# EAGLE design Qwiic GPS-RTK2 - ublox ZED-F9P (EAGLE 9.5.1)
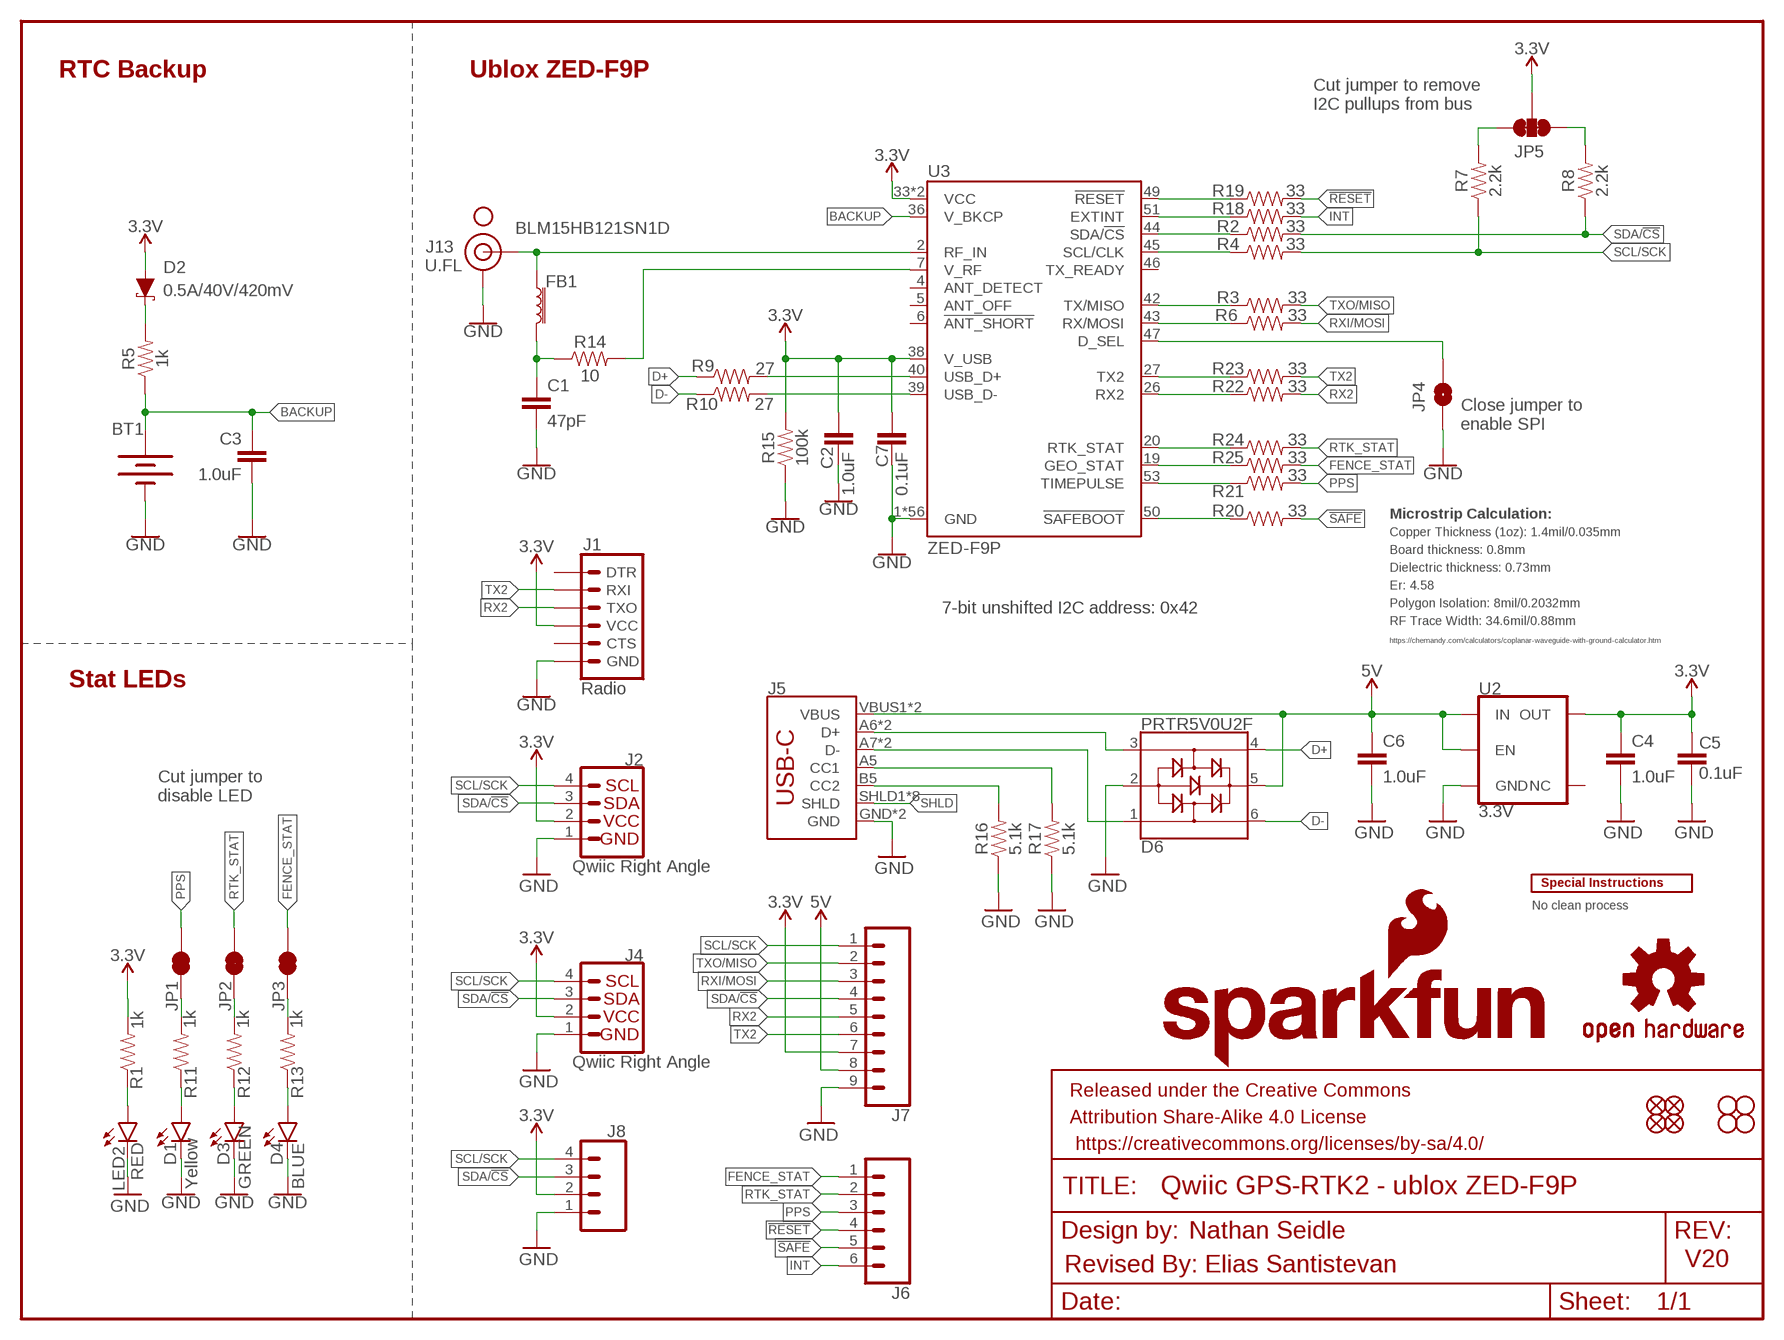
[diagram p0: schematic, sheet 1]

## Parts
BT1  ML414H_IV01E_BATTERY  [ML414H_IV01E]
C1  47pF  47PF-0603-50V-5%  [0603]
C2  1.0uF  1.0UF-0603-16V-10%  [0603]
C3  1.0uF  1.0UF-0603-16V-10%  [0603]
C4  1.0uF  1.0UF-0603-16V-10%  [0603]
C5  0.1uF  0.1UF-0603-25V-(+80/-20%)  [0603]
C6  1.0uF  1.0UF-0603-16V-10%  [0603]
C7  0.1uF  0.1UF-0603-25V-(+80/-20%)  [0603]
D1  Yellow  LED-YELLOW0603  [LED-0603]
D2  0.5A/40V/420mV  DIODE-SCHOTTKY-PMEG4005EJ  [SOD-323]
D3  GREEN  LED-GREEN0603  [LED-0603]
D4  BLUE  LED-BLUE0603  [LED-0603]
D6  PRTR5V0U2F  [SOT886]
FB1  FERRITE_BEAD-120_OHM-0402  [0402]
FRAME1  FRAME-LETTER  [CREATIVE_COMMONS]
J1  Radio  6_PIN_SERIAL_TARGET_NO_SILK  [1X06_NO_SILK]
J2  Qwiic Right Angle  I2C_STANDARDQWIIC  [JST04_1MM_RA]
J4  Qwiic Right Angle  I2C_STANDARDQWIIC  [JST04_1MM_RA]
J5  USB_C2-LAYER  [USB-C-16P]
J6  CONN_06NO_SILK_FEMALE_PTH  [1X06_NO_SILK]
J7  CONN_09NO_SILK  [1X09_NO_SILK]
J8  CONN_041X04_NO_SILK  [1X04_NO_SILK]
J13  U.FL  U.FL2PIN  [U.FL]
JP1  JUMPER-SMT_2_NC_TRACE_SILK  [SMT-JUMPER_2_NC_TRACE_SILK]
JP2  JUMPER-SMT_2_NC_TRACE_SILK  [SMT-JUMPER_2_NC_TRACE_SILK]
JP3  JUMPER-SMT_2_NC_TRACE_SILK  [SMT-JUMPER_2_NC_TRACE_SILK]
JP4  JUMPER-SMT_2_NO_SILK  [SMT-JUMPER_2_NO_SILK]
JP5  JUMPER-SMT_3_2-NC_TRACE_SILK  [SMT-JUMPER_3_2-NC_TRACE_SILK]
JP21  FIDUCIALUFIDUCIAL  [FIDUCIAL-MICRO]
JP31  STAND-OFFTIGHT  [STAND-OFF-TIGHT]
JP41  STAND-OFFTIGHT  [STAND-OFF-TIGHT]
JP61  FIDUCIALUFIDUCIAL  [FIDUCIAL-MICRO]
JP71  FIDUCIALUFIDUCIAL  [FIDUCIAL-MICRO]
JP81  FIDUCIALUFIDUCIAL  [FIDUCIAL-MICRO]
JP91  STAND-OFFTIGHT  [STAND-OFF-TIGHT]
JP101  STAND-OFFTIGHT  [STAND-OFF-TIGHT]
LED2  RED  LED-RED0603  [LED-0603]
LOGO1  OSHW-LOGOMINI  [OSHW-LOGO-MINI]
LOGO2  SFE_LOGO_NAME_FLAME.1_INCH  [SFE_LOGO_NAME_FLAME_.1]
R1  1k  1KOHM-0603-1/10W-1%  [0603]
R2  33  33OHM-0603-1/10W-1%  [0603]
R3  33  33OHM-0603-1/10W-1%  [0603]
R4  33  33OHM-0603-1/10W-1%  [0603]
R5  1k  1KOHM-0603-1/10W-1%  [0603]
R6  33  33OHM-0603-1/10W-1%  [0603]
R7  2.2k  2.2KOHM-0603-1/10W-1%  [0603]
R8  2.2k  2.2KOHM-0603-1/10W-1%  [0603]
R9  27  27OHM-0603-1/10W-1%  [0603]
R10  27  27OHM-0603-1/10W-1%  [0603]
R11  1k  1KOHM-0603-1/10W-1%  [0603]
R12  1k  1KOHM-0603-1/10W-1%  [0603]
R13  1k  1KOHM-0603-1/10W-1%  [0603]
R14  10  10OHM-0603-1/10W-1%  [0603]
R15  100k  100KOHM-0603-1/10W-1%  [0603]
R16  5.1k  5.1KOHM5.1KOHM-0603-1/10W-1%  [0603]
R17  5.1k  5.1KOHM5.1KOHM-0603-1/10W-1%  [0603]
R18  33  33OHM-0603-1/10W-1%  [0603]
R19  33  33OHM-0603-1/10W-1%  [0603]
R20  33  33OHM-0603-1/10W-1%  [0603]
R21  33  33OHM-0603-1/10W-1%  [0603]
R22  33  33OHM-0603-1/10W-1%  [0603]
R23  33  33OHM-0603-1/10W-1%  [0603]
R24  33  33OHM-0603-1/10W-1%  [0603]
R25  33  33OHM-0603-1/10W-1%  [0603]
U2  3.3V  V_REG_AP2112K-3.3V  [SOT23-5]
U3  ZED-F9P  [ZED-F9P]
U$2  SPECIAL_INSTRUCTIONS-ORDERING  [ORDERING_INSTRUCTIONS]
U$54  SMA-ANTENNA-THREADED  [SMA-THREADED]

## Nets
3.3V [3.3V]: C2.1 C4.1 C5.2 C7.2 D2.A J1.4(VCC) J2.2 J4.2 J7.7 J8.2 JP5.2 R1.2 R15.2 U2.5(OUT) U3.33(VCC) U3.34(VCC) U3.38(V_USB)
5V: C6.1 D6.5 J5.VBUS1(VBUS) J5.VBUS2(VBUS) J7.8 U2.1(IN) U2.3(EN)
!RESET: J6.4 R19.2
!SAFE: J6.5 R20.2
ANT_VCC: C1.1 FB1.2 R14.1
BACKUP: BT1.+ C3.1 R5.1 U3.36(V_BKCP)
CC1: J5.A5(CC1) R17.2
CC2: J5.B5(CC2) R16.2
D+: D6.4 R9.1
D-: D6.6 R10.1
D_SEL: JP4.2 U3.47(D_SEL)
FENCE_STAT: J6.1 JP3.2 R25.2
GND: BT1.- C1.2 C2.2 C3.2 C4.2 C5.1 C6.2 C7.1 D1.C D3.C D4.C D6.2 J1.6(GND) J2.1 J4.1 J5.GND J5.GND2(GND) J7.9 J8.1 J13.1(GND) J13.2(GND) JP4.1 LED2.C R15.1 R16.1 R17.1 U2.2(GND) U3.1(GND) U3.3(GND) U3.12(GND) U3.14(GND) U3.32(GND) U3.37(GND) U3.41(GND) U3.48(GND) U3.55(GND) U3.56(GND) U3.57(GND) U3.58(GND) U3.59(GND) U3.60(GND) U3.61(GND) U3.62(GND) U3.63(GND) U3.64(GND) U3.65(GND) U3.66(GND) U3.67(GND) U3.68(GND) U3.69(GND) U3.70(GND) U3.71(GND) U3.72(GND) U3.73(GND) U3.74(GND) U3.75(GND) U3.76(GND) U3.77(GND) U3.78(GND) U3.79(GND) U3.80(GND) U3.81(GND) U3.82(GND) U3.83(GND) U3.84(GND) U3.85(GND) U3.86(GND) U3.87(GND) U3.88(GND) U3.89(GND) U3.90(GND) U3.91(GND) U3.92(GND) U3.93(GND) U3.94(GND) U3.95(GND) U3.96(GND) U3.97(GND) U3.98(GND) U3.99(GND) U3.100(GND) U3.101(GND) U3.102(GND)
GPS_ANT1: FB1.1 J13.FEED(SIGNAL) U3.2(RF_IN)
INT: J6.6 R18.2
N$1: D3.A R12.1
N$2: D1.A R11.1
N$3: JP2.1 R12.2
N$4: JP1.1 R11.2
N$5: JP5.1 R8.2
N$6: D2.C R5.2
N$7: D4.A R13.1
N$8: JP5.3 R7.2
N$9: JP3.1 R13.2
N$10: LED2.A R1.1
N$11: R9.2 U3.40(USB_D+)
N$12: R10.2 U3.39(USB_D-)
N$13: R14.2 U3.7(V_RF)
N$14: R22.1 U3.26(RX2)
N$15: R18.1 U3.51(EXTINT)
N$16: R19.1 U3.49(!RESET!)
N$17: R21.1 U3.53(TIMEPULSE)
N$18: R20.1 U3.50(!SAFEBOOT!)
N$19: R24.1 U3.20(RTK_STAT)
N$20: R25.1 U3.19(GEO_STAT)
PPS: J6.3 JP1.2 R21.2
RTK_STAT: J6.2 JP2.2 R24.2
RX2: J1.3(TXO) J7.5 R22.2
RXI/MOSI: J7.3 R6.2
RXLV: R6.1 U3.43(RX/MOSI)
SCL/SCK: J2.4 J4.4 J7.1 J8.4 R4.2 R7.1
SCL_LV: R4.1 U3.45(SCL/CLK)
SDA/!CS: J2.3 J4.3 J7.4 J8.3 R2.2 R8.1
SDA_LV: R2.1 U3.44(SDA/!CS!)
SHLD: J5.SHLD1(SHLD) J5.SHLD2(SHLD) J5.SHLD3(SHLD) J5.SHLD4(SHLD) J5.SHLD5(SHLD) J5.SHLD6(SHLD) J5.SHLD7(SHLD) J5.SHLD8(SHLD)
TX2: J1.2(RXI) J7.6 R23.2
TX2_P: R23.1 U3.27(TX2)
TXLV: R3.1 U3.42(TX/MISO)
TXO/MISO: J7.2 R3.2
UNP_D+: D6.3 J5.A6(D+) J5.B6(D+)
UNP_D-: D6.1 J5.A7(D-) J5.B7(D-)
Unconnected: J1.1(DTR) J1.5(CTS) U2.4(NC) U3.4(ANT_DETECT) U3.5(ANT_OFF) U3.6(!ANT_SHORT!) U3.46(TX_READY)

## Notes on the sheet
- RTC Backup | Ublox ZED-F9P
- Cut jumper to remove 
  I2C pullups from bus
- BLM15HB121SN1D
- Close jumper to
  enable SPI
- Microstrip Calculation:
- Copper Thickness (1oz): 1.4mil/0.035mm
- Board thickness: 0.8mm
- Dielectric thickness: 0.73mm
- Er: 4.58
- 7-bit unshifted I2C address: 0x42 | Polygon Isolation: 8mil/0.2032mm
- RF Trace Width: 34.6mil/0.88mm
- https://chemandy.com/calculators/coplanar-waveguide-with-ground-calculator.htm
- Stat LEDs
- Cut jumper to 
  disable LED
- No clean process
- Nathan Seidle
- Revised By: Elias Santistevan | V20

## Library data of the parts
BT1 = SparkFun-Batteries:ML414H_IV01E_BATTERY: SEIKO ML414H-IV01E Reflowable Lithium Battery ML414H is a rechargeable, coin type battery with features such as Pb-free reflowable (Peak temperature: 260 C) and high temperature heat resistance. Battery Characteristics: 3.1V max voltage Voff is 2V 1mAH 3k series resistor with battery 72 hour charge time from 2.0-3.1V 2.3-2.8V initial charge; PROD_ID: BATT-14267
C1 = SparkFun-Capacitors:47PF: 47pF ceramic capacitors A capacitor is a passive two-terminal electrical component used to store electrical energy temporarily in an electric field.; PROD_ID: CAP-08913
C2-C4 C6 = SparkFun-Capacitors:1.0UF: 1µF ceramic capacitors A capacitor is a passive two-terminal electrical component used to store electrical energy temporarily in an electric field.; PROD_ID: CAP-00868
C5 C7 = SparkFun-Capacitors:0.1UF: 0.1µF ceramic capacitors A capacitor is a passive two-terminal electrical component used to store electrical energy temporarily in an electric field.; PROD_ID: CAP-00810
D1 = SparkFun-LED:LED-YELLOW: Yellow SMD LED Used in manufacturing several products at SparkFun. Packages: 0603 - SMD 0603 package[Product Link] <http://www.kingbrightusa.com/product.asp?catalog_name=LED&product_id=APT1608SYCK> 0603 -SMART - SMART SMD 0603 package (more efficient/more expensive) [Product Link] <http://www.osram-os.com/osram_os/en/products/product-catalog/led-light-emitting-diodes/smartled-0603/ly-l29k/index.jsp> LilyPad - SMD1206 package[Product Datasheet] <https://www.sparkfun.com/datasheets/DevTools/LilyPad/Q150YUS4.pdf> SparkFun Products: Blynk Board <https://www.sparkfun.com/products/13794> IOIO-OTG <https://www.sparkfun.com/products/13613> XBee Explorer Serial <https://www.sparkfun.com/products/13225>; PROD_ID: DIO-09003
D2 = SparkFun-DiscreteSemi:DIODE-SCHOTTKY: Schottky diode A Schottky diode is a semiconductor diode which has a low forward voltage drop and a very fast switching action.; PROD_ID: DIO-10955
D3 = SparkFun-LED:LED-GREEN: Green SMD LED Used in manufacturing of various products at SparkFun Packages: 0603 - SMD 0603 package [Product Link] <http://www.futureelectronics.com/en/technologies/semiconductors/optoelectronics/leds/Pages/9894312-LTST-C190GKT.aspx?CrossPart=HSMG-C190&IM=0> LilyPad 1206 - SMD1206 LilyPad package [Product Link] <http://www.futureelectronics.com/en/Technologies/Product.aspx?ProductID=IN150NGHARVATEKCORPORATION2049943&IM=0> 1206 - SMD1206 package [Product Link] <http://www.futureelectronics.com/en/technologies/semiconductors/optoelectronics/leds/Pages/8315665-LTST-C150KGKT.aspx?IM=0> 1206 Bottom Mount -SMD 1206 Bottom Mount [Product Link] <http://www.digikey.com/product-detail/en/lite-on-inc/LTST-C230KGKT/160-1456-1-ND/386854> SparkFun Products: Pro Mini 328 -5V <https://www.sparkfun.com/products/821> RedBoard <https://www.sparkfun.com/products/12757> MP3 Trigger <https://www.sparkfun.com/products/13720> Makey Makey <https://www.sparkfun.com/products/11076>; PROD_ID: DIO-00821
D4 = SparkFun-LED:LED-BLUE: Blue SMD LED Used in manufacturing of various products at SparkFun Packages: 0603 - SMD 0603 package [Product Link] <http://www.digikey.com/product-detail/en/SMLE12BC7TT86/511-1589-2-ND/1641808> 1206 - SMD1206 package [Product Link] <http://www.digikey.com/product-detail/en/lite-on-inc/LTST-C150TBKT/160-1643-1-ND/573584> SparkFun Products: ESP8266 Thing-Dev Board <https://www.sparkfun.com/products/13711> RedBoard <https://www.sparkfun.com/products/12757>; PROD_ID: DIO-08575
D6 = SparkFun-IC-Power:PRTR5V0U2: A small ESD protection device. Most commonly used on USB D+/D- signals to protect large, expensive, or especially sensitive USB enabled devices.; PROD_ID: DIO-14084
FB1 = SparkFun-Coils:FERRITE_BEAD-120_OHM: Ferrite Bead (blocks, cores, rings, chokes, etc.) Inductor with layers of ferrite used to suppress high frequencies. Often used to isolate high frequency noise.; MFG_PART: BLM15HB121SN1D; PROD_ID: NDUC-14206
FRAME1 = SparkFun-Aesthetics:FRAME-LETTER: Schematic Frame - Letter Standard 8.5x11 US Letter frame
J1 = SparkFun-Connectors:6_PIN_SERIAL_TARGET: 6-pin header connection for use with the "FTDI BASIC" pinout - TARGET SIDE. Also known as "Arduino Serial Program Header". It is used to mate with our FTDI Basic serial programmers using the Arduino IDE. Note, this device has "TARGET" in the name. It is intended to be used on a design that contains a target micro-controller that you wish to program. The "sister" device, named "CABLE" is inteneded to be used on a design that usually lives on the end of your USB cable and prvides the converter chip (FTDI232 or FTDI231x) to commnicate serial RX/TX. You can populate with some of these: Break Away Headers - Straight <https://www.sparkfun.com/products/116> (PRT-00116) For reference (or to suit your programming needs) check out these designs: SparkFun FTDI Basic Breakout - 5V <https://www.sparkfun.com/products/9716> (DEV-09716) SparkFun FTDI Basic Breakout - 3.3V <https://www.sparkfun.com/products/9873> (DEV-09873) SparkFun FTDI SmartBasic <https://www.sparkfun.com/products/12935> (DEV-12935) SparkFun Beefy 3 - FTDI Basic Breakout <https://www.sparkfun.com/products/13746> (DEV-13746)
J2 J4 = SparkFun-Connectors:I2C_STANDARD: SparkFun I2C Standard Pinout Header SparkFun has standardized on a pinout for all I2C based sensor breakouts. This pinout allows I2C boards to be plugged directly into the headers on Arduino Uno compatible boards, and to be daisy chained easily. Example SparkFun Products: SparkFun Atmospheric Sensor Breakout - BME280 <https://www.sparkfun.com/products/13676> SparkFun Altitude/Pressure Sensor Breakout - MPL3115A2 <https://www.sparkfun.com/products/11084> SparkFun TOF Range Finder Sensor - VL6180 <https://www.sparkfun.com/products/12785>; PROD_ID: CONN-13694
J5 = SparkFun-Connectors:USB_C: USB Type C 16Pin Connector Super Speed pins not available on the 16-pin purely SMD connector so this part is best for USB 2.0 implementations. D1 and D2 are tied together enabling D+/- no matter which way the cable is plugged into the connector. The two channel configuration pins (CC1/2) are exposed. These are normally connected to ground via 5.1k resistors but can be reconfigured for high current/high power applications.; PROD_ID: CONN-14122
J6 = SparkFun-Connectors:CONN_06: Multi connection point. Often used as Generic Header-pin footprint for 0.1 inch spaced/style header connections On any of the 0.1 inch spaced packages, you can populate with these: Break Away Headers - Straight <https://www.sparkfun.com/products/116> (PRT-00116) Break Away Male Headers - Right Angle <https://www.sparkfun.com/products/553> (PRT-00553) Female Headers <https://www.sparkfun.com/products/115> (PRT-00115) Break Away Headers - Machine Pin <https://www.sparkfun.com/products/117> (PRT-00117) Break Away Female Headers - Swiss Machine Pin <https://www.sparkfun.com/products/743> (PRT-00743) Arduino Stackable Header - 6 Pin <https://www.sparkfun.com/products/9280> (PRT-09280) For SCREWTERMINALS and SPRING TERMINALS visit here: Screw Terimnals on SparkFun.com <https://www.sparkfun.com/search/results?term=Screw+Terminals> (5mm/3.5mm/2.54mm spacing) This device is also useful as a general connection point to wire up your design to another part of your project. Our various solder wires solder well into these plated through hole pads. Hook-Up Wire - Assortment (Stranded, 22 AWG) <https://www.sparkfun.com/products/11375> (PRT-11375) Hook-Up Wire - Assortment (Solid Core, 22 AWG) <https://www.sparkfun.com/products/11367> (PRT-11367) View the entire wire category on our website here <https://www.sparkfun.com/categories/141>; PROD_ID: CONN-08437
J7 = SparkFun-Connectors:CONN_09: Multi connection point. Often used as Generic Header-pin footprint for 0.1 inch spaced/style header connections On any of the 0.1 inch spaced packages, you can populate with these: Break Away Headers - Straight <https://www.sparkfun.com/products/116> (PRT-00116) Break Away Male Headers - Right Angle <https://www.sparkfun.com/products/553> (PRT-00553) Female Headers <https://www.sparkfun.com/products/115> (PRT-00115) Break Away Headers - Machine Pin <https://www.sparkfun.com/products/117> (PRT-00117) Break Away Female Headers - Swiss Machine Pin <https://www.sparkfun.com/products/743> (PRT-00743) For SCREWTERMINALS and SPRING TERMINALS visit here: Screw Terimnals on SparkFun.com <https://www.sparkfun.com/search/results?term=Screw+Terminals> (5mm/3.5mm/2.54mm spacing) This device is also useful as a general connection point to wire up your design to another part of your project. Our various solder wires solder well into these plated through hole pads. Hook-Up Wire - Assortment (Stranded, 22 AWG) <https://www.sparkfun.com/products/11375> (PRT-11375) Hook-Up Wire - Assortment (Solid Core, 22 AWG) <https://www.sparkfun.com/products/11367> (PRT-11367) View the entire wire category on our website here <https://www.sparkfun.com/categories/141> Special notes: Molex polarized connector foot print use with SKU : PRT-08231 with associated crimp pins and housings. 1MM SMD Version SKU: PRT-10208 NOTES ON THE VARIANTS LOCK and LOCK_LONGPADS... This footprint was designed to help hold the alignment of a through-hole component (i.e. 6-pin header) while soldering it into place. You may notice that each hole has been shifted either up or down by 0.005 of an inch from it's more standard position (which is a perfectly straight line). This slight alteration caused the pins (the squares in the middle) to touch the edges of the holes. Because they are alternating, it causes a "brace" to hold the component in place. 0.005 has proven to be the perfect amount of "off-center" position when using our standard breakaway headers. Although looks a little odd when you look at the bare footprint, once you have a header in there, the alteration is very hard to notice. Also,if you push a header all the way into place, it is covered up entirely on the bottom side.
J8 = SparkFun-Connectors:CONN_04: Multi connection point. Often used as Generic Header-pin footprint for 0.1 inch spaced/style header connections On any of the 0.1 inch spaced packages, you can populate with these: Break Away Headers - Straight <https://www.sparkfun.com/products/116> (PRT-00116) Break Away Male Headers - Right Angle <https://www.sparkfun.com/products/553> (PRT-00553) Female Headers <https://www.sparkfun.com/products/115> (PRT-00115) Break Away Headers - Machine Pin <https://www.sparkfun.com/products/117> (PRT-00117) Break Away Female Headers - Swiss Machine Pin <https://www.sparkfun.com/products/743> (PRT-00743) For SCREWTERMINALS and SPRING TERMINALS visit here: Screw Terimnals on SparkFun.com <https://www.sparkfun.com/search/results?term=Screw+Terminals> (5mm/3.5mm/2.54mm spacing) This device is also useful as a general connection point to wire up your design to another part of your project. Our various solder wires solder well into these plated through hole pads. Hook-Up Wire - Assortment (Stranded, 22 AWG) <https://www.sparkfun.com/products/11375> (PRT-11375) Hook-Up Wire - Assortment (Solid Core, 22 AWG) <https://www.sparkfun.com/products/11367> (PRT-11367) View the entire wire category on our website here <https://www.sparkfun.com/categories/141> Special notes: Molex polarized connector foot print use with SKU : PRT-08231 with associated crimp pins and housings. 1MM SMD Version SKU: PRT-10208; PROD_ID: CONN-09696
J13 = SparkFun-Connectors:U.FL2PIN: SMD Antenna Connector - U.FL 2mm height, 3.0mm x 3.0mm receptacle size. SparkFun Products: SparkFun WiFi Shield - ESP8266 <https://www.sparkfun.com/products/13287> SparkFun ESP8266 Thing <https://www.sparkfun.com/products/13231> SparkFun MiniGen - Pro Mini Signal Generator Shield <https://www.sparkfun.com/products/11420>; PROD_ID: CONN-09193; SF_ID: WRL-09144
JP1-JP3 = SparkFun-Jumpers:JUMPER-SMT_2_NC_TRACE: Normally closed trace jumper This jumper has a trace between two pads so it's normally closed (NC). Use a razor knife to open the connection. For best results follow the IPC guidelines for cutting traces: Cutout at least 0.063 mm (0.005 in). Remove all loose material to clean up the cut area. Seal the cut with an approved epoxy. Reapply solder to reclose the connection.
JP4 = SparkFun-Jumpers:JUMPER-SMT_2_NO: Normally open jumper This jumper has two pads in close proximity to each other. Apply solder to close the connection. Round pads are easier to solder for beginners, but are a lot larger. SparkFun Product that uses the round pads: SparkFun EL Sequencer <https://www.sparkfun.com/products/12781>
JP5 = SparkFun-Jumpers:JUMPER-SMT_3_2-NC_TRACE: Normally closed trace jumper (2 of 2 connections) This jumper has a trace between all three pads so they are normally closed (NC). Use a razor knife to open the connection(s). For best results follow the IPC guidelines for cutting traces: Cutout at least 0.063 mm (0.005 in). Remove all loose material to clean up the cut area. Seal the cut with an approved epoxy. Reapply solder to reclose the connection(s).
JP21 JP61 JP71 JP81 = SparkFun-Aesthetics:FIDUCIAL: Fiducial Alignment Points Point-of-reference for pick-and-place machines and other optical instruments.
JP31 JP41 JP91 JP101 = SparkFun-Hardware:STAND-OFF: Stand Off Drill holes for mechanically mounting via screws, standoffs, etc. Note: Use the keepout ring to avoid running the screw head into surrounding components. Variant Overviews STAND-OFF - Mechanical footprint for a #4 phillips button head screw. STAND-OFF-TIGHT - Mechanical footprint for a #4 phillips button head screw, Example SparkFun Products Screw - Phillips Head (1/4", 4-40, 10 pack) <https://www.sparkfun.com/products/10453> (PRT-10453) Screw - Phillips Head (1/2", 4-40, 10 pack) <https://www.sparkfun.com/products/10452> (PRT-10452) Screw - Phillips Head (3/4", 4-40, 10 pack) <https://www.sparkfun.com/products/10451> (PRT-10451) Screw - Phillips Head (1", 4-40, 10 pack) <https://www.sparkfun.com/products/10450> (PRT-10450)
LED2 = SparkFun-LED:LED-RED: Red SMD LED Used in manufacturing of most products at SparkFun Packages: 0603 - SMD 0603 package [Product Link] <http://docs.avagotech.com/docs/AV02-0551EN> 0603 SMART - SMD 0603 SMART package ( more efficient and expensive)[Product Link] <http://www.osram-os.com/Graphics/XPic2/00077099_0.pdf> 1206 - SMD1206 package [Product Link] <https://www.sparkfun.com/datasheets/DevTools/LilyPad/Q150OVS4.pdff> SparkFun Products: Pro Mini 328 -5V <https://www.sparkfun.com/products/821> RedBoard <https://www.sparkfun.com/products/12757> IOIO-OTG <https://www.sparkfun.com/products/13613>; PROD_ID: DIO-00819
LOGO1 = SparkFun-Aesthetics:OSHW-LOGO: Open-Source Hardware (OSHW) Logo This logo indicates the piece of hardware it is found on incorporates a OSHW license and/or adheres to the definition of open source hardware found here: http://freedomdefined.org/OSHW
LOGO2 = SparkFun-Aesthetics:SFE_LOGO_NAME_FLAME: SparkFun Font Logo w/ Flame This is the SparkFun full logo. The logo on the schematic will always be the same size; the package variant is the height of the flame part of the logo. Default layer for the logo on the board is tSilk.
R1 R5 R11-R13 = SparkFun-Resistors:1KOHM: 1kΩ resistor A resistor is a passive two-terminal electrical component that implements electrical resistance as a circuit element. Resistors act to reduce current flow, and, at the same time, act to lower voltage levels within circuits. - Wikipedia; PROD_ID: RES-07856
R2-R4 R6 R18-R25 = SparkFun-Resistors:33OHM: 33Ω resistor A resistor is a passive two-terminal electrical component that implements electrical resistance as a circuit element. Resistors act to reduce current flow, and, at the same time, act to lower voltage levels within circuits. - Wikipedia; PROD_ID: RES-08270
R7 R8 = SparkFun-Resistors:2.2KOHM: 2.2kΩ resistor A resistor is a passive two-terminal electrical component that implements electrical resistance as a circuit element. Resistors act to reduce current flow, and, at the same time, act to lower voltage levels within circuits. - Wikipedia; PROD_ID: RES-08272
R9 R10 = SparkFun-Resistors:27OHM: 27Ω resistor A resistor is a passive two-terminal electrical component that implements electrical resistance as a circuit element. Resistors act to reduce current flow, and, at the same time, act to lower voltage levels within circuits. - Wikipedia; PROD_ID: RES-09334
R14 = SparkFun-Resistors:10OHM: 10Ω resistor A resistor is a passive two-terminal electrical component that implements electrical resistance as a circuit element. Resistors act to reduce current flow, and, at the same time, act to lower voltage levels within circuits. - Wikipedia; PROD_ID: RES-12581
R15 = SparkFun-Resistors:100KOHM: 100kΩ resistor A resistor is a passive two-terminal electrical component that implements electrical resistance as a circuit element. Resistors act to reduce current flow, and, at the same time, act to lower voltage levels within circuits. - Wikipedia; PROD_ID: RES-07828
R16 R17 = SparkFun-Resistors:5.1KOHM; PROD_ID: RES-12083
U2 = SparkFun-IC-Power:V_REG_AP2112: AP2112 - 600mA CMOS LDO Regulator w/ Enable The AP2112 is CMOS process low dropout linear regulator with enable function, the regulator delivers a guaranteed 600mA (min.) continuous load current. Features Output Voltage Accuracy: ±1.5% Output Current: 600mA (Min.) Foldback Short Current Protection: 50mA Enable Function to Turn ON/OFF VOUT Low Dropout Voltage (3.3V): 250mV (Typ.) @IOUT=600mA Excellent Load Regulation: 0.2%/A (Typ.) Excellent Line Regulation: 0.02%/V (Typ.) Low Quiescent Current: 55μA (Typ.) Low Standby Current: 0.01μA (Typ.) Low Output Noise: 50μVRMS PSRR: 100Hz -65dB, 1kHz -65dB OTSD Protection Stable with 1.0μF Flexible Cap: Ceramic, Tantalum and Aluminum Electrolytic Operation Temperature Range: -40°C to 85°C ESD: MM 400V, HBM 4000V; PROD_ID: VREG-12457
U3 = SparkFun-GPS:ZED-F9P; PROD_ID: IC-14209
U$2 = SparkFun-Aesthetics:SPECIAL_INSTRUCTIONS: Special Ordering/Production Instructions Alert Symbol for special PCB ordering instructions or unique production process warnings. Ordering Instructions Production Instructions Types of information that should be added to box: Copper weight Soldermask color Silk color PCB thickness Number of layers PCB Standard: 1.6mm FR4 1 oz copper immersion silver plating red soldermask white silkscreen Types of information that should be added to box: Special wash requirements Depaneling instructions Humidification Glue curing Default text settings: 0.07 inch 9% ratio 50% line distance
U$54 = SparkFun-Hardware:SMA-ANTENNA-THREADED: This is a milled 'D' shaped hole that permits a standard threaded SMA female connector to be inserted and attached through a PCB.

## Net classes
1 power: width 0.178 mm
2 3.3V: width 0.508 mm

## Board
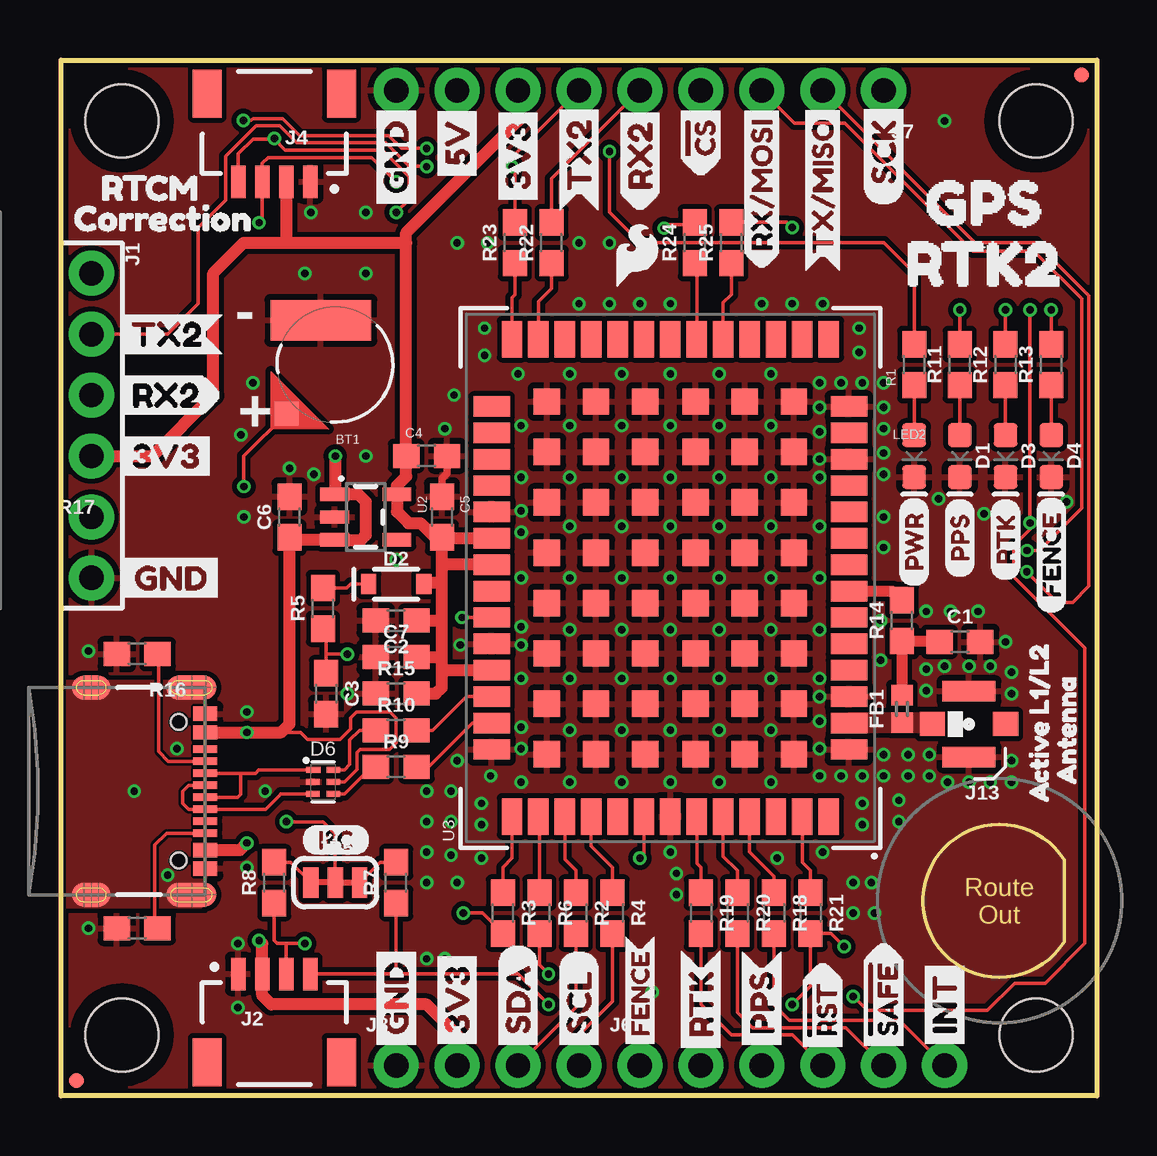
[diagram p1: board, top side]
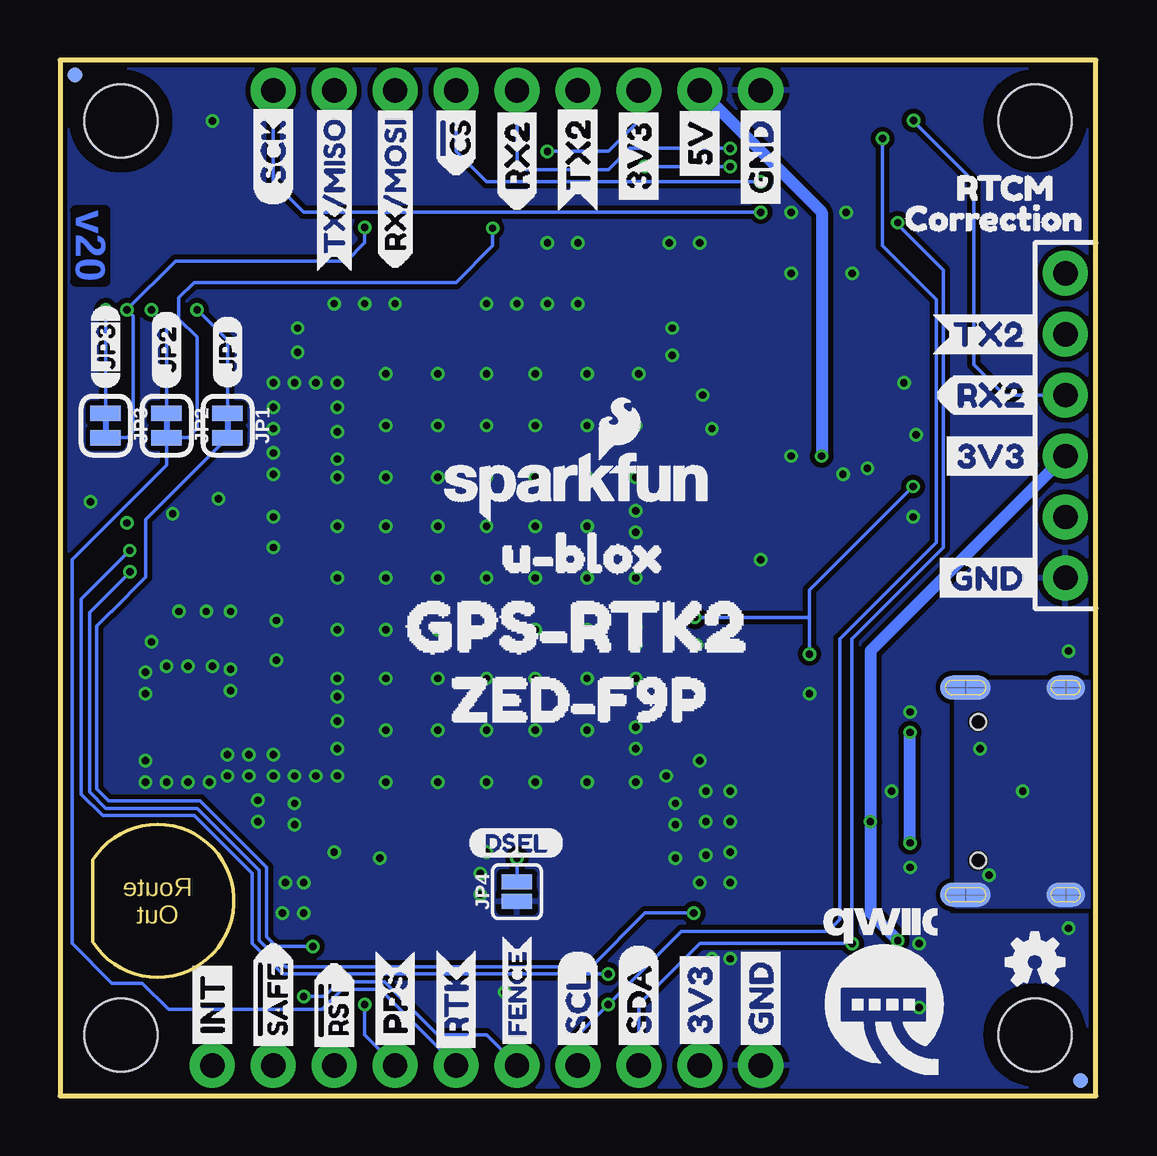
[diagram p2: board, bottom side, seen from below]

Size 43.18 x 43.18 mm. Coordinates in mm from the lower left corner, seen from the top.
Outline: 43.18,0 0,0 0,43.18 43.18,43.18 43.18,0
Copper layers (1*16): Top 0.035mm / dielectric 1.5mm / Bottom 0.035mm
Design rules "SparkFun-2-layer-FAB-LIMIT": minimum track width 4mil, minimum drill 6mil, track to track 4mil, track to pad 4mil, pad to pad 4mil, via to via 4mil, smd to smd 4mil, copper to edge 4mil, drill to drill 4mil, minimum pad ring 5mil, minimum via ring 5mil, stop-mask expansion 4mil, vias tented up to drill 25mil, thermal gap 10mil
tRestrict: area 37.3,14.7 to 38.7,16.3

### Footprints (pad centres in the part's own frame; a part is rotated, then mirrored left to right if it is on the bottom)
ML414H_IV01E = smd 1 x 1: + 2.022,2.032 | smd 4.2 x 1.7: - 0.6,-1.85
0603 = smd 1.1 x 1: 1 -0.85,0; 2 0.85,0
LED-0603 = smd 1 x 1: A -0.877,0; C 0.877,0
SOD-323 = smd 0.63 x 0.83: A 1.15,0; C -1.15,0
SOT886 = smd 0.61 x 0.25: 1 -0.405,0.5 | smd 0.56 x 0.25: 2 -0.43,0; 3 -0.43,-0.5; 4 0.43,-0.5; 5 0.43,0; 6 0.43,0.5
0402 = smd 0.85 x 0.9: 1 -0.58,0; 2 0.58,0
1X06_NO_SILK = drill 1.016 pad 1.88: 1 0,0; 2 2.54,0; 3 5.08,0; 4 7.62,0; 5 10.16,0; 6 12.7,0
JST04_1MM_RA = smd 0.6 x 1.35: 1 -1.5,0; 2 -0.5,0; 3 0.5,0; 4 1.5,0 | smd 1.2 x 2: NC1 2.8,-3.675; NC2 -2.8,-3.675
USB-C-16P = smd 0.3 x 1: A5 -1.25,-0.34; A6 -0.25,-0.34; A7 0.25,-0.34; A8 1.25,-0.34; B5 1.75,-0.34; B6 0.75,-0.34; B7 -0.75,-0.34; B8 -1.75,-0.34 | smd 0.6 x 1: GND -3.225,-0.34; GND2 3.225,-0.34; VBUS1 -2.45,-0.34; VBUS2 2.45,-0.34 | smd 1 x 2.1: SHLD1 -4.32,-0.915; SHLD2 4.32,-0.915 | smd 1 x 2.1 bottom: SHLD3 -4.32,-0.915; SHLD4 4.32,-0.915 | smd 1 x 1.6: SHLD5 -4.32,-5.095; SHLD8 4.32,-5.095 | smd 1 x 1.6 bottom: SHLD6 -4.32,-5.095; SHLD7 4.32,-5.095 | hole 0.65: -2.89,-1.445; 2.89,-1.445
1X09_NO_SILK = drill 1.016 pad 1.88: 1 0,0; 2 2.54,0; 3 5.08,0; 4 7.62,0; 5 10.16,0; 6 12.7,0; 7 15.24,0; 8 17.78,0; 9 20.32,0
1X04_NO_SILK = drill 1.016 pad 1.88: 1 0,0; 2 2.54,0; 3 5.08,0; 4 7.62,0
U.FL = smd 2.2 x 0.85: 1 0,1.375; 2 0,-1.375 | smd 1.05 x 1: FEED 1.525,0; NC -1.525,0
SMT-JUMPER_2_NC_TRACE_SILK = smd 0.635 x 1.27: 1 -0.508,0; 2 0.508,0
SMT-JUMPER_2_NO_SILK = smd 0.635 x 1.27: 1 -0.406,0; 2 0.406,0
SMT-JUMPER_3_2-NC_TRACE_SILK = smd 0.635 x 1.27: 1 -1.016,0; 2 0,0; 3 1.016,0
FIDUCIAL-MICRO = smd 0.635 x 0.635: 1 0,0
STAND-OFF-TIGHT = hole 3.048: 0,0
SOT23-5 = smd 0.55 x 1.2: 1 -0.95,-1.3; 2 0,-1.3; 3 0.95,-1.3; 4 0.95,1.3; 5 -0.95,1.3
ZED-F9P = smd 0.85 x 1.52: 1 -7.15,-7.45; 2 -6.05,-7.45; 3 -4.95,-7.45; 4 -3.85,-7.45; 5 -2.75,-7.45; 6 -1.65,-7.45; 7 -0.55,-7.45; 8 0.55,-7.45; 9 1.65,-7.45; 10 2.75,-7.45; 11 3.85,-7.45; 12 4.95,-7.45; 13 6.05,-7.45; 14 7.15,-7.45; 28 7.15,7.45; 29 6.05,7.45; 30 4.95,7.45; 31 3.85,7.45; 32 2.75,7.45; 33 1.65,7.45; 34 0.55,7.45; 35 -0.55,7.45; 36 -1.65,7.45; 37 -2.75,7.45; 38 -3.85,7.45; 39 -4.95,7.45; 40 -6.05,7.45; 41 -7.15,7.45 | smd 1.52 x 0.85: 15 9.95,-6.6; 16 9.95,-5.5; 17 9.95,-4.4; 18 9.95,-3.3; 19 9.95,-2.2; 20 9.95,-1.1; 21 9.95,0; 22 9.95,1.1; 23 9.95,2.2; 24 9.95,3.3; 25 9.95,4.4; 26 9.95,5.5; 27 9.95,6.6; 42 -9.95,6.6; 43 -9.95,5.5; 44 -9.95,4.4; 45 -9.95,3.3; 46 -9.95,2.2; 47 -9.95,1.1; 48 -9.95,0; 49 -9.95,-1.1; 50 -9.95,-2.2; 51 -9.95,-3.3; 52 -9.95,-4.4; 53 -9.95,-5.5; 54 -9.95,-6.6 | smd 1.1 x 1.1: 55 -1.05,-1.05; 56 -3.15,-1.05; 57 -5.25,-1.05; 58 -7.35,-1.05; 59 -1.05,-3.1; 60 -3.15,-3.1; 61 -5.25,-3.1; 62 -7.35,-3.1; 63 -1.05,-5.15; 64 -3.15,-5.15; 65 -5.25,-5.15; 66 -7.35,-5.15; 67 -1.05,5.15; 68 -3.15,5.15; 69 -5.25,5.15; 70 -7.35,5.15; 71 -1.05,3.1; 72 -3.15,3.1; 73 -5.25,3.1; 74 -7.35,3.1; 75 -1.05,1.05; 76 -3.15,1.05; 77 -5.25,1.05; 78 -7.35,1.05; 79 1.05,1.05; 80 3.15,1.05; 81 5.25,1.05; 82 7.35,1.05; 83 1.05,3.1; 84 3.15,3.1; 85 5.25,3.1; 86 7.35,3.1; 87 1.05,5.15; 88 3.15,5.15; 89 5.25,5.15; 90 7.35,5.15; 91 1.05,-5.15; 92 3.15,-5.15; 93 5.25,-5.15; 94 7.35,-5.15; 95 1.05,-3.1; 96 3.15,-3.1; 97 5.25,-3.1; 98 7.35,-3.1; 99 1.05,-1.05; 100 3.15,-1.05; 101 5.25,-1.05; 102 7.35,-1.05

### Placement (x,y rotation side)
BT1  11.43,30.48 180 top
C1  37.47,18.92 0 top
C2  13.97,19.81 180 top
C3  11.05,16.76 270 top
C4  15.24,26.67 0 top
C5  15.88,24.13 270 top
C6  9.53,24.13 90 top
C7  13.97,18.29 0 top
D1  37.47,26.67 270 top
D2  13.97,21.34 0 top
D3  39.37,26.67 270 top
D4  41.27,26.67 270 top
D6  10.92,13.08 0 top
FB1  35.05,16.13 90 top
FRAME1  -17.78,-17.78 0 top  (outside the outline)
J1  1.27,34.29 270 top
J2  8.89,5.08 0 top
J4  8.89,38.1 180 top
J5  6.35,12.7 270 top
J6  24.13,1.27 0 top
J7  34.29,41.91 180 top
J8  13.97,1.27 0 top
J13  37.85,15.49 180 top
JP1  36.2,27.94 270 bottom
JP2  38.73,27.94 270 bottom
JP3  41.27,27.94 270 bottom
JP4  24.13,8.51 90 bottom
JP5  11.43,8.89 0 top
JP21  42.55,42.55 90 top
JP31  2.54,2.54 90 top
JP41  2.54,40.64 90 top
JP61  0.64,0.64 90 top
JP71  42.55,42.55 270 bottom
JP81  0.64,0.64 270 bottom
JP91  40.64,2.54 90 top
JP101  40.64,40.64 90 top
LED2  35.56,26.67 270 top
LOGO1  2.54,5.59 0 bottom
LOGO2  21.59,25.4 0 bottom
R1  35.56,30.48 90 top
R2  21.46,7.62 270 top
R3  18.41,7.62 270 top
R4  22.99,7.62 270 top
R5  10.92,20.32 90 top
R6  19.94,7.62 270 top
R7  13.97,8.89 90 top
R8  8.89,8.89 90 top
R9  13.97,13.72 0 top
R10  13.97,15.24 0 top
R11  37.47,30.48 90 top
R12  39.37,30.48 90 top
R13  41.27,30.48 90 top
R14  35.05,19.81 90 top
R15  13.97,16.76 0 top
R16  3.17,6.99 0 top
R17  3.17,18.41 0 top
R18  29.72,7.62 270 top
R19  26.67,7.62 270 top
R20  28.19,7.62 270 top
R21  31.24,7.62 270 top
R22  20.45,35.56 90 top
R23  18.92,35.56 90 top
R24  26.42,35.56 90 top
R25  27.94,35.56 90 top
U2  12.7,24.13 270 top
U3  25.4,21.59 90 top
U$1  [SDA-[)]  19.05,1.65 90 top
U$2  57.15,54.61 0 top  (outside the outline)
U$3  [SCL-[)]  21.59,1.65 90 top
U$4  [SDA-[)]  19.05,1.65 90 bottom
U$5  [SCL-[)]  21.59,1.65 90 bottom
U$6  [3V3-04]  16.51,1.65 90 top
U$7  [3V3-04]  16.51,1.65 90 bottom
U$8  [GND-04]  13.97,1.65 90 top
U$9  [GND-04]  13.97,1.65 90 bottom
U$10  [I_SUPER2_C-()-03]  10.03,10.67 0 top
U$11  [FENCE2]  41.27,20.07 90 top
U$12  [JP20]  38.73,29.46 90 bottom
U$13  [RTK1]  39.37,21.46 90 top
U$14  [FENCE0]  24.13,1.78 90 top
U$15  [INT8]  36.83,1.65 90 top
U$16  [INT8]  36.83,1.65 90 bottom
U$17  [FENCE0]  24.13,1.78 90 bottom
U$18  [PWR-()-03]  35.56,21.21 90 top
U$19  [5V]  16.51,37.85 90 top
U$20  [5V]  16.51,37.85 90 bottom
U$21  [RX20]  24.13,36.83 90 top
U$22  [U#BLOX3]  26.16,22.61 0 bottom
U$23  [CS#-<]]  26.67,38.1 90 top
U$24  [CS#-<]]  26.67,38.1 90 bottom
U$25  [JP10]  36.2,29.46 90 bottom
U$26  [RX#MOSI3]  29.21,34.42 90 top
U$27  [DSEL0]  26.16,10.54 0 bottom
U$28  [RTK1]  26.67,1.52 90 bottom
U$29  [RTK1]  26.67,1.52 90 top
U$30  [QWIIC-LOGO-MEDIUM]  8.89,4.32 0 bottom
U$31  [RX#MOSI3]  29.21,34.42 90 bottom
U$32  [JP32]  41.27,29.46 90 bottom
U$33  [SFE_LOGO_FLAME_.1]  24,35.05 0 top
U$34  [TX#MISO1]  31.75,34.29 90 top
U$35  [#RST3]  31.75,1.4 90 top
U$36  [#RST3]  31.75,1.4 90 bottom
U$37  [TX#MISO1]  31.75,34.29 90 bottom
U$38  [SCK-(]-04]  34.29,37.08 90 top
U$39  [#SAFE1]  34.29,1.4 90 top
U$40  [#SAFE1]  34.29,1.4 90 bottom
U$41  [SCK-(]-04]  34.29,37.08 90 bottom
U$42  [RX22]  2.03,29.21 0 top
U$43  [PPS5]  29.21,1.65 90 top
U$44  [PPS5]  29.21,1.65 90 bottom
U$45  [GND3]  2.16,21.59 0 top
U$46  [GPS#RTK28]  30.61,19.56 0 bottom
U$48  [RTCM5]  6.73,37.85 0 bottom
U$49  [ZED#F9P6]  28.45,16.51 0 bottom
U$50  [TX21]  21.59,36.83 90 top
U$51  [TX23]  2.03,31.75 0 top
U$52  [PPS0]  37.47,21.59 90 top
U$53  [CORRECTION0]  8.89,36.58 0 bottom
U$54  39.12,8.13 0 top
U$55  [TX21]  21.59,36.83 90 bottom
U$56  [RX20]  24.13,36.83 90 bottom
U$57  [TX21]  6.86,31.75 0 bottom
U$58  [RX20]  6.73,29.21 0 bottom
U$59  [GPS0]  34.42,37.21 0 top
U$60  [3V3-04]  19.05,36.83 90 bottom
U$61  [3V3-04]  19.05,36.83 90 top
U$62  [GND-04]  13.97,36.7 90 bottom
U$63  [GND-04]  13.97,36.7 90 top
U$64  [RTK21]  33.27,34.67 0 top
U$65  [ACTIVE_L1#L21]  40.77,11.56 90 top
U$66  [3V3-04]  2.03,26.67 0 top
U$67  [3V3-04]  6.73,26.67 0 bottom
U$68  [GND3]  6.99,21.59 0 bottom
U$69  [CORRECTION0]  -0.38,36.58 0 top
U$70  [RTCM5]  0.76,37.85 0 top
U$71  [ANTENNA2]  41.91,12.32 90 top

### Tracks (layer width: path | path; a pad name or v marks a point on that pad's centre or on a via)
3.3V  (via drill 0.3)
  Top 0.152: R1.2 35.56,34.29 34.29,35.56 24.13,35.56 22.86,36.83 v22.86,39.37 | JP5.2 11.43,10.92 10.92,11.43 v9.4,11.43
  Top 0.508: U3.33 15.91,23.24 C5.2 | 15.88,21.38 15.12,21.38 D2.A | C5.2 15.58,23.28 14.99,23.88 14.48,23.88 14,24.35 U2.5 14,25.43 14.39,25.82 C4.1 14.39,35.56 | J7.7 19.05,40.64 14.39,35.98 14.39,35.56 | 9.53,35.56 7.62,35.56 6.35,34.29 6.35,29.21 3.81,26.67 J1.4 | 9.53,35.56 14.39,35.56 | 9.53,35.56 9.39,35.7 J4.2 | 15.88,18.29 15.88,19.81 | 15.88,19.81 15.88,21.38 | v8.26,6.48 8.39,6.34 J2.2 8.39,4.18 8.76,3.81 15.24,3.81 16.51,2.54 J8.2 | 15.88,21.38 15.88,22.1 | 15.88,22.1 C5.2 | U3.34 15.92,22.14 15.88,22.1 | C2.1 15.88,19.81 | C7.2 15.88,18.29 | R15.2 15.62,16.76 15.88,17.02 15.88,17.78 | 15.88,17.78 15.88,18.29 | U3.38 15.91,17.74 15.88,17.78
  Bottom 0.152: v22.86,39.37 20.32,39.37 19.05,40.64 J7.7
  Bottom 0.508: v8.26,6.48 9.4,7.62 v9.4,11.43 9.4,18.54 J1.4
5V  (via drill 0.3)
  Top 0.152: 9.18,15.15 10,15.15 10.29,14.86 11.63,14.86 12.06,15.29 12.06,15.75 12.32,16 13.72,16 13.75,15.97 13.77,15.97 13.97,15.76 13.97,14.72 13.7,14.45 12.47,14.45 12.34,14.31 12.34,13.61 11.81,13.08 D6.5
  Top 0.508: J5.VBUS1 v7.75,15.15 9.18,15.15 9.53,15.49 C6.1 9.62,23.18 U2.3 12.51,23.18 12.7,23.37 12.7,24.77 12.38,25.08 11.43,25.08 | U2.1 11.43,25.08 | v11.43,26.67 11.43,25.08 | J5.VBUS2 7.46,10.25 v7.75,10.54
  Bottom 0.508: v11.43,26.67 11.43,36.83 J7.8 | v7.75,10.54 v7.75,15.15
!RESET
  Top 0.152: J6.4 30.48,2.54 27.94,2.54 26.67,3.81 R19.2
!SAFE
  Top 0.152: J6.5 32.72,2.85 28.83,2.85 28.19,3.48 R20.2
ANT_VCC
  Top 0.457: C1.1 36.58,18.96 R14.1 FB1.2
BACKUP  (via drill 0.3)
  Top 0.152: U3.36 v16.71,19.94 | C3.1 11.05,18.41 | 11.05,18.41 11.05,19.34 R5.1 | v11.94,18.41 11.05,18.41 | BT1.+ 7.62,26.66 v7.62,25.4
  Bottom 0.152: v16.71,19.94 11.94,19.94 | v7.62,25.4 11.94,21.08 11.94,19.94 | v11.94,18.41 11.94,19.94
CC1
  Top 0.152: J5.A5 4.46,13.95 4.06,14.35 4.06,18.38 R17.2
CC2
  Top 0.152: J5.B5 4.4,10.95 3.9,10.45 3.9,7.11 R16.2
D+
  Top 0.152: R9.1 12.95,13.72 11.82,12.58 D6.4
D-
  Top 0.152: R10.1 12.45,15.24 12.04,14.83 12.04,13.81 11.81,13.59 D6.6
D_SEL  (via drill 0.3)
  Top 0.152: U3.47 24.3,10.08 v24.13,9.91
  Bottom 0.152: v24.13,9.91 JP4.2
FENCE_STAT  (via drill 0.3)
  Top 0.152: v40.39,32.77 v40.39,23.88 40.39,23.61 39.73,22.94 39.73,21.62 42.67,18.68 42.67,6.35 41.02,4.7 39.75,4.7 38.61,3.56 33.6,3.56 v33.02,4.14 | R25.2 30.27,36.41 v30.48,36.2
  Bottom 0.152: JP3.2 40.39,27.43 40.13,27.69 40.13,32.51 v40.39,32.77 38.36,34.8 31.24,34.8 30.48,35.56 v30.48,36.2 | J6.1 25.4,2.54 27.43,2.54 29.64,4.75 31.55,4.75 32.16,4.14 v33.02,4.14
GND  (via drill 0.3)
  Top 0.305: C4.2 16.09,25.96 15.88,25.74 C5.1
  other vias: 29.59,13.08 11.94,16.76 10.54,25.91 9.53,26.16 7.49,27.56 16,27.81 34.29,26.8 34.29,28.7 34.29,14.22 35.31,14.22 36.2,14.22 36.07,16.89 37.85,17.91 39.62,16.76 39.62,13.97 37.85,13.08 39.37,18.92 8.51,12.7 10.41,36.83 7.37,6.35 7.75,9.53 7.75,16 31.62,14.48 31.62,13.34 32.51,13.34 33.4,13.34 34.29,13.34 31.62,15.62 31.62,16.64 31.62,26.54 31.62,28.7 31.62,29.72 32.51,29.72 33.4,29.72 34.29,29.72 19.18,24.38 19.18,18.8 27.43,13.08 25.4,13.08 23.37,13.08 21.21,13.08 19.18,14.48 21.21,15.24 21.21,17.4 23.37,17.4 23.37,15.24 25.4,15.24 25.4,17.4 27.43,17.4 27.43,15.24 29.59,15.24 29.59,17.4 29.59,19.43 27.43,19.43 25.4,19.43 23.37,19.43 21.21,19.43 21.21,21.59 21.21,23.75 23.37,23.75 23.37,21.59 25.4,21.59 25.4,23.75 27.43,23.75 27.43,21.59 29.59,21.59 29.59,23.75 29.59,25.78 27.43,25.78 25.4,25.78 23.37,25.78 21.21,25.78 21.21,27.94 21.21,30.1 23.37,30.1 23.37,27.94 25.4,27.94 25.4,30.1 27.43,30.1 27.43,27.94 29.59,27.94 29.59,30.1 31.62,27.69 25.4,10.16 35.31,13.34 36.2,13.34 36.07,17.78 36.83,17.91 38.73,17.91 39.62,17.65 39.62,13.08 38.73,13.08 36.96,13.08 17.91,13.34 16.51,13.97 33.4,11.3 33.4,12.19 17.53,12.19 17.53,11.3 19.05,30.1 19.18,27.94 19.18,25.78 19.18,21.59 19.18,19.56 19.18,17.4 19.18,15.37 19.18,13.08 31.62,17.4 31.62,19.43 31.62,21.59 31.62,23.75 31.62,25.78 33.27,32 33.27,30.99 17.65,32 17.65,30.86 19.18,23.5 34.29,27.81 34.29,25.91 36.58,24.89 38.48,24.26 41.91,24.77 36.83,40.64 21.59,35.56 12.7,36.83 12.7,34.29 10.16,34.29 8,29.72 13.97,22.35 12.7,26.67 1.14,18.54 1.14,6.99 7.37,3.68 29.84,9.91 38.23,20.19 37.08,20.19 36.07,20.19 34.16,18.16 34.16,19.81 15.24,5.71 16,5.71 15.24,8.89 16.51,8.89 15.24,10.16 15.24,11.43 15.24,12.7 25.65,8.38 33.02,8.89 33.78,8.89 33.91,7.62 33.02,7.62 31.75,10.16 31.75,33.02 30.48,33.02 29.21,33.02 24.13,33.02 25.4,33.02 22.86,33.02 21.59,33.02 16.38,29.21 17.78,35.56 16.51,35.56 22.86,35.56 25.65,9.27 16.26,12.7 16.26,11.43 16.26,10.03 17.53,9.91 34.92,11.43 34.92,12.32 34.29,24.13 34.29,22.86 16.64,18.8 7.62,24.13 24.64,4.32
  pour Top (isolate 0.203, rank 4): 0,0 0,43.18 43.18,43.18 43.18,0
  pour Bottom (isolate 0.203, rank 4): 0,0 0,43.18 43.18,43.18 43.18,0
GPS_ANT1
  pour Top (isolate 0.152, no thermals): 32.82,15.91 32.82,15.19 36.64,15.19 36.64,15.91
INT
  Top 0.152: J6.6 34.95,3.15 30.35,3.15 29.72,3.79 R18.2
N$1
  Top 0.152: R12.1 D3.A
N$2
  Top 0.152: R11.1 D1.A
N$3  (via drill 0.3)
  Top 0.152: v39.37,32.77 R12.2
  Bottom 0.152: JP2.1 38.73,32.13 v39.37,32.77
N$4  (via drill 0.3)
  Top 0.152: v37.47,32.77 R11.2
  Bottom 0.152: JP1.1 36.2,31.5 v37.47,32.77
N$5
  Top 0.152: R8.2 9.56,9.74 JP5.1
N$6
  Top 0.152: R5.2 11.9,21.17 12.06,21.34 D2.C
N$7
  Top 0.152: R13.1 D4.A
N$8
  Top 0.152: R7.2 13.3,9.74 JP5.3
N$9  (via drill 0.3)
  Top 0.152: v41.27,32.77 R13.2
  Bottom 0.152: JP3.1 v41.27,32.77
N$10
  Top 0.152: R1.1 LED2.A
N$11
  Top 0.152: R9.2 15.33,13.72 17.15,15.54 U3.40
N$12
  Top 0.152: U3.39 16.89,16.64 15.49,15.24 R10.2
N$13
  Top 0.457: U3.7 34.67,21.04 R14.2
N$14
  Top 0.152: U3.26 19.9,33.11 20.45,33.66 R22.1
N$15
  Top 0.152: U3.51 28.7,10.16 29.72,9.14 R18.1
N$16
  Top 0.152: U3.49 26.5,9.7 26.67,9.53 R19.1
N$17
  Top 0.152: U3.53 30.9,9.74 31.24,9.4 R21.1
N$18
  Top 0.152: U3.50 27.6,9.99 28.19,9.4 R20.1
N$19
  Top 0.152: R24.1 26.5,34.63 U3.20
N$20
  Top 0.152: U3.19 27.6,33.06 27.94,33.4 R25.1
PPS  (via drill 0.3)
  Top 0.152: v30.48,3.81 31.24,4.57 R21.2 32.09,6.77 v32.64,6.22
  Bottom 0.152: v30.48,3.81 30.48,2.54 J6.3 | JP1.2 39.6,24.02 39.6,21.62 41.05,20.17 41.06,20.17 41.64,19.58 41.64,12.79 41.15,12.29 37.34,12.29 34.57,9.52 34.57,6.63 34.16,6.22 v32.64,6.22
RTK_STAT  (via drill 0.3)
  Top 0.152: R24.2 26.33,36.32 25.15,36.32 v25.15,36.17
  Bottom 0.152: J6.2 29.84,4.45 31.42,4.45 32.26,3.61 38.66,3.61 39.75,4.7 41.02,4.7 42.67,6.35 42.67,22.35 38.73,26.29 JP2.2 37.85,27.43 37.47,27.81 37.47,31.62 38.23,32.38 38.23,33.27 37.59,33.91 26.67,33.91 25.15,35.43 v25.15,36.17
RX2  (via drill 0.3)
  Top 0.152: v7.6,40.66 7.92,40.66 8,40.74 9.24,40.74 9.95,40.03 13.66,40.03 14.19,39.5 v15.24,39.5 | R22.2 20.45,38.23 J7.5
  Bottom 0.152: v7.6,40.66 7.62,40.64 5.08,38.1 5.08,30.48 3.81,29.21 J1.3 | v15.24,39.5 19.43,39.5 20.32,38.61 23.75,38.61 24.13,38.99 J7.5
RXI/MOSI  (via drill 0.3)
  Top 0.152: R6.2 19.94,5.46 v20.32,5.08 | v40.27,22.73 40.78,22.73 42.55,24.5 42.55,33.22 40.55,35.22 38.01,35.22 32.68,40.55 30.57,40.55 J7.3
  Bottom 0.152: v20.32,5.08 33.91,5.08 35.18,6.35 35.18,9.27 37.59,11.68 41.4,11.68 42.29,12.57 42.29,20.71 v40.27,22.73
RXLV
  Top 0.152: U3.43 19.94,11.6 R6.1
SCL/SCK  (via drill 0.3)
  Top 0.152: R4.2 22.99,3.94 21.59,2.54 J8.4 | v20.32,3.81 19.05,5.08 13.97,5.08 | J2.4 13.97,5.08 | R7.1 13.97,5.08 | J4.4 7.39,39.27 8,39.88 8.87,39.88 8.88,39.89 | v8.89,39.9 8.88,39.89 | 8.88,39.89 9.35,39.42 13.4,39.42 14.5,38.32 14.5,37.36 v13.97,36.83
  Bottom 0.152: J7.1 34.29,38.1 33.02,36.83 v13.97,36.83 | v8.89,39.9 8.89,35.43 6.66,33.2 6.66,23.06 10.67,19.05 10.67,7.37 11.18,6.86 17.27,6.86 v20.32,3.81 21.59,2.54 J8.4
SCL_LV
  Top 0.152: U3.45 22.1,10.41 22.99,9.53 R4.1
SDA/!CS  (via drill 0.3)
  Top 0.152: R2.2 21.46,3.68 J8.3 | R8.1 8.89,6.48 9.02,6.35 9.4,6.35 | v10.16,6.35 9.4,6.35 | 9.4,6.35 9.39,6.34 J2.3 | v13.97,38.1 12.95,39.12 8.64,39.12 8.39,38.87 J4.3 8.39,36.53 v8.26,36.4
  Bottom 0.152: J7.4 26.67,39.37 25.4,38.1 v13.97,38.1 | v8.26,36.4 8.26,36.32 6.35,34.42 6.35,22.86 10.16,19.05 v10.16,6.35 16.51,6.35 19.05,3.81 J8.3
SDA_LV
  Top 0.152: U3.44 21,9.86 21.46,9.4 R2.1
SHLD  (via drill 0.3)
  other vias: 3.05,12.7 4.45,9.19 4.83,14.48
  pour Top (no thermals): 0,17.27 5.84,17.27 5.84,7.87 0,7.87
  pour Bottom (no thermals): 0,17.27 5.84,17.27 5.84,7.87 0,7.87
TX2  (via drill 0.3)
  Top 0.152: J7.6 18.8,39.12 v18.8,38.73 18.92,38.61 R23.2 | v15.24,38.73 15.22,38.76 14.5,38.76 13.53,39.73 9.82,39.73 9.11,40.44 8.13,40.44 6.86,39.17 6.86,37.34 5.71,36.2 5.71,33.02 4.45,31.75 J1.2
  Bottom 0.152: v15.24,38.73 v18.8,38.73
TX2_P
  Top 0.152: U3.27 18.8,33.28 18.92,33.4 R23.1
TXLV
  Top 0.152: U3.42 18.8,9.91 18.41,9.53 R3.1
TXO/MISO  (via drill 0.3)
  Top 0.152: R3.2 17.57,7.62 v16.76,7.62 | v40.26,21.84 41.53,20.57 42.16,20.57 42.85,21.26 42.85,33.35 40.64,35.56 38.1,35.56 J7.2
  Bottom 0.152: v16.76,7.62 18.8,7.62 21.03,5.38 33.78,5.38 34.87,6.48 34.87,9.4 37.47,11.99 41.28,11.99 41.95,12.66 41.95,20.16 v40.26,21.84
UNP_D+
  Top 0.152: J5.A6 5.33,12.95 5.08,12.7 5.08,12.19 5.32,11.95 J5.B6 8.52,11.95 9.08,12.51 9.15,12.58 D6.3
UNP_D-
  Top 0.152: J5.B7 7.49,13.45 | 7.49,13.45 8.12,13.45 8.25,13.58 D6.1 | J5.A7 7.37,12.45 7.49,12.57 7.49,13.45

### Text on the board
Bottom: v20
tPlace: - | +
Measures: Measurements in inches
tDocu: Board thickness is 0.8mm | No clean process | Nathan Seidle | Revised By: Elias Santistevan